# EAGLE design ESP32_breakout v1 (EAGLE 7.7.0)
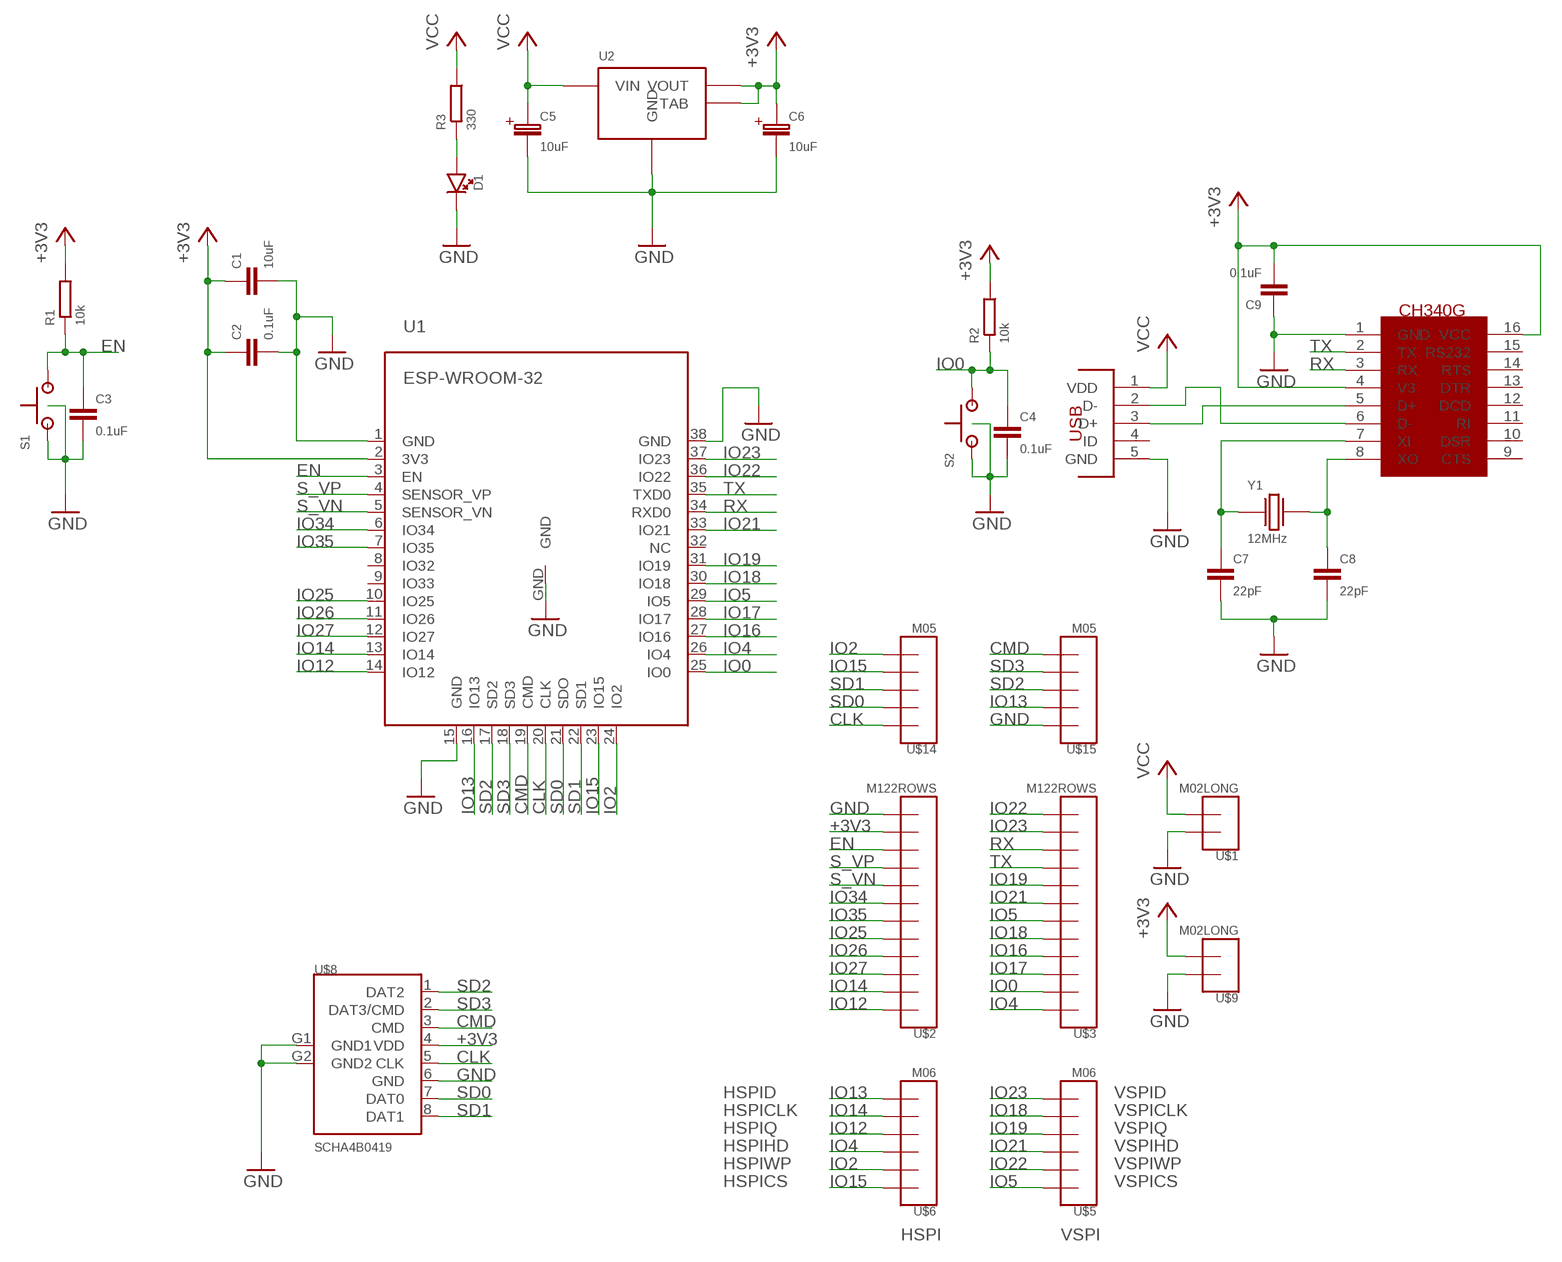
[diagram p0: schematic, sheet 1]

## Parts
C1  10uF  CAP0603  [CAP-0603]
C2  0.1uF  CAP0603  [CAP-0603]
C3  0.1uF  CAP0603  [CAP-0603]
C4  0.1uF  CAP0603  [CAP-0603]
C5  10uF  CAP-POLARCASEB-3528  [B-3528]
C6  10uF  CAP-POLARCASEB-3528  [B-3528]
C7  22pF  CAP0603  [CAP-0603]
C8  22pF  CAP0603  [CAP-0603]
C9  0.1uF  CAP0603  [CAP-0603]
D1  LED1206  [LED-1206]
R1  10k  RESISTOR0603  [RES-0603]
R2  10k  RESISTOR0603  [RES-0603]
R3  330  RESISTOR0603  [RES-0603]
S1  SKHMQME010  [SKHMQME010]
S2  SKHMQME010  [SKHMQME010]
U1  ESP-WROOM-32  [ESP-WROOM-32]
U2  NCP-1117  [SOT-223-4]
U$1  M02LONG  [1X02-LONG]
U$2  M122ROWS  [2X06]
U$3  M122ROWS  [2X06]
U$4  MOLEX_USBMICRO  [MOLEX_47346-001]
U$5  M06  [1X06]
U$6  M06  [1X06]
U$7  CH340G  [SOIC16]
U$8  SCHA4B0419  [MICROSD_SCHA4B0419]
U$9  M02LONG  [1X02-LONG]
U$14  M05  [1X05]
U$15  M05  [1X05]
Y1  12MHz  ABLS-12MHZ-B2-T  [HC-49/US]

## Nets
+3V3: C1.1 C2.1 C6.P C9.2 R1.2 R2.2 U1.2(3V3) U2.2(VOUT) U2.PAD(TAB) U$2.11 U$7.4(V3) U$7.16(VCC) U$8.4(VDD) U$9.2
CLK: U1.20(CLK) U$8.5(CLK) U$14.1
CMD: U1.19(CMD) U$8.3(CMD) U$15.5
EN: C3.1 R1.1 S1.3 U1.3(EN) U$2.10
GND: C1.2 C2.2 C3.2 C4.2 C5.N C6.N C7.2 C8.2 C9.1 D1.C S1.1 S1.5 S2.1 S2.5 U1.1(GND) U1.15(GND) U1.38(GND) U1.GND U2.1(GND) U$1.1 U$2.12 U$4.5(GND) U$7.1(GND) U$8.6(GND) U$8.G1(GND1) U$8.G2(GND2) U$9.1 U$15.1
IO0: C4.1 R2.1 S2.3 U1.25(IO0) U$3.2
IO2: U1.24(IO2) U$6.2 U$14.5
IO4: U1.26(IO4) U$3.1 U$6.3
IO5: U1.29(IO5) U$3.6 U$5.1
IO12: U1.14(IO12) U$2.1 U$6.4
IO13: U1.16(IO13) U$6.6 U$15.2
IO14: U1.13(IO14) U$2.2 U$6.5
IO15: U1.23(IO15) U$6.1 U$14.4
IO16: U1.27(IO16) U$3.4
IO17: U1.28(IO17) U$3.3
IO18: U1.30(IO18) U$3.5 U$5.5
IO19: U1.31(IO19) U$3.8 U$5.4
IO21: U1.33(IO21) U$3.7 U$5.3
IO22: U1.36(IO22) U$3.12 U$5.2
IO23: U1.37(IO23) U$3.11 U$5.6
IO25: U1.10(IO25) U$2.5
IO26: U1.11(IO26) U$2.4
IO27: U1.12(IO27) U$2.3
IO34: U1.6(IO34) U$2.7
IO35: U1.7(IO35) U$2.6
N$1: D1.A R3.1
N$3: C7.1 U$7.7(XI) Y1.P$1
N$4: C8.1 U$7.8(XO) Y1.P$2
N$5: U$4.3(D+) U$7.5(D+)
N$6: U$4.2(D-) U$7.6(D-)
RX: U1.34(RXD0) U$3.10 U$7.3(RX)
S_VN: U1.5(SENSOR_VN) U$2.8
S_VP: U1.4(SENSOR_VP) U$2.9
SD0: U1.21(SDO) U$8.7(DAT0) U$14.2
SD1: U1.22(SD1) U$8.8(DAT1) U$14.3
SD2: U1.17(SD2) U$8.1(DAT2) U$15.3
SD3: U1.18(SD3) U$8.2(DAT3/CMD) U$15.4
TX: U1.35(TXD0) U$3.9 U$7.2(TX)
VCC: C5.P R3.2 U2.3(VIN) U$1.2 U$4.1(VDD)
Unconnected: U1.8(IO32) U1.9(IO33) U1.32(NC) U$4.4(ID) U$7.9(CTS) U$7.10(DSR) U$7.11(RI) U$7.12(DCD) U$7.13(DTR) U$7.14(RTS) U$7.15(RS232)

## Notes on the sheet
- HSPID | VSPID
- HSPICLK | VSPICLK
- HSPIQ | VSPIQ
- HSPIHD | VSPIHD
- HSPIWP | VSPIWP
- HSPICS | VSPICS
- HSPI | VSPI

## Library data of the parts
C1-C4 C7-C9 = dr-library:CAP: Multilayer Ceramic Capacitor
C5 C6 = dr-library:CAP-POLAR
D1 = dr-library:LED
R1-R3 = dr-library:RESISTOR
S1 S2 = dr-library:SKHMQME010: ALPS Tactile Switch 50mA at 12V Mouser Product # 688-SKHMQME010
U1 = dr-library:ESP-WROOM-32
U2 = dr-library:NCP-1117: ON Semiconductor Low Dropout Positive Voltage Regulator 1A output Datasheet: http://www.mouser.com/ds/2/308/NCP1117LP-D-82673.pdf
U$1 U$9 = dr-library:M02
U$2 U$3 = dr-library:M12
U$4 = dr-library:MOLEX_USBMICRO
U$5 U$6 = dr-library:M06
U$7 = usb-serial:CH340G
U$8 = dr-library:SCHA4B0419: ALPS MicroSD Connector Manufacturer No. SCHA4B0419 http://www2.mouser.com/ProductDetail/ALPS/SCHA4B0419/?qs=sGAEpiMZZMuJakaoiLiBpsFSICW6cUCj0ci6XSEAGXcTwv1T7afZMw%3d%3d
U$14 U$15 = dr-library:M05
Y1 = dr-library:ABLS-12MHZ-B2-T: Abracon 12MHz Crystal 20ppm 18pF Load Cap Manufacturer Part No. - ABLS-12.000MHZ-B2-T

## Board
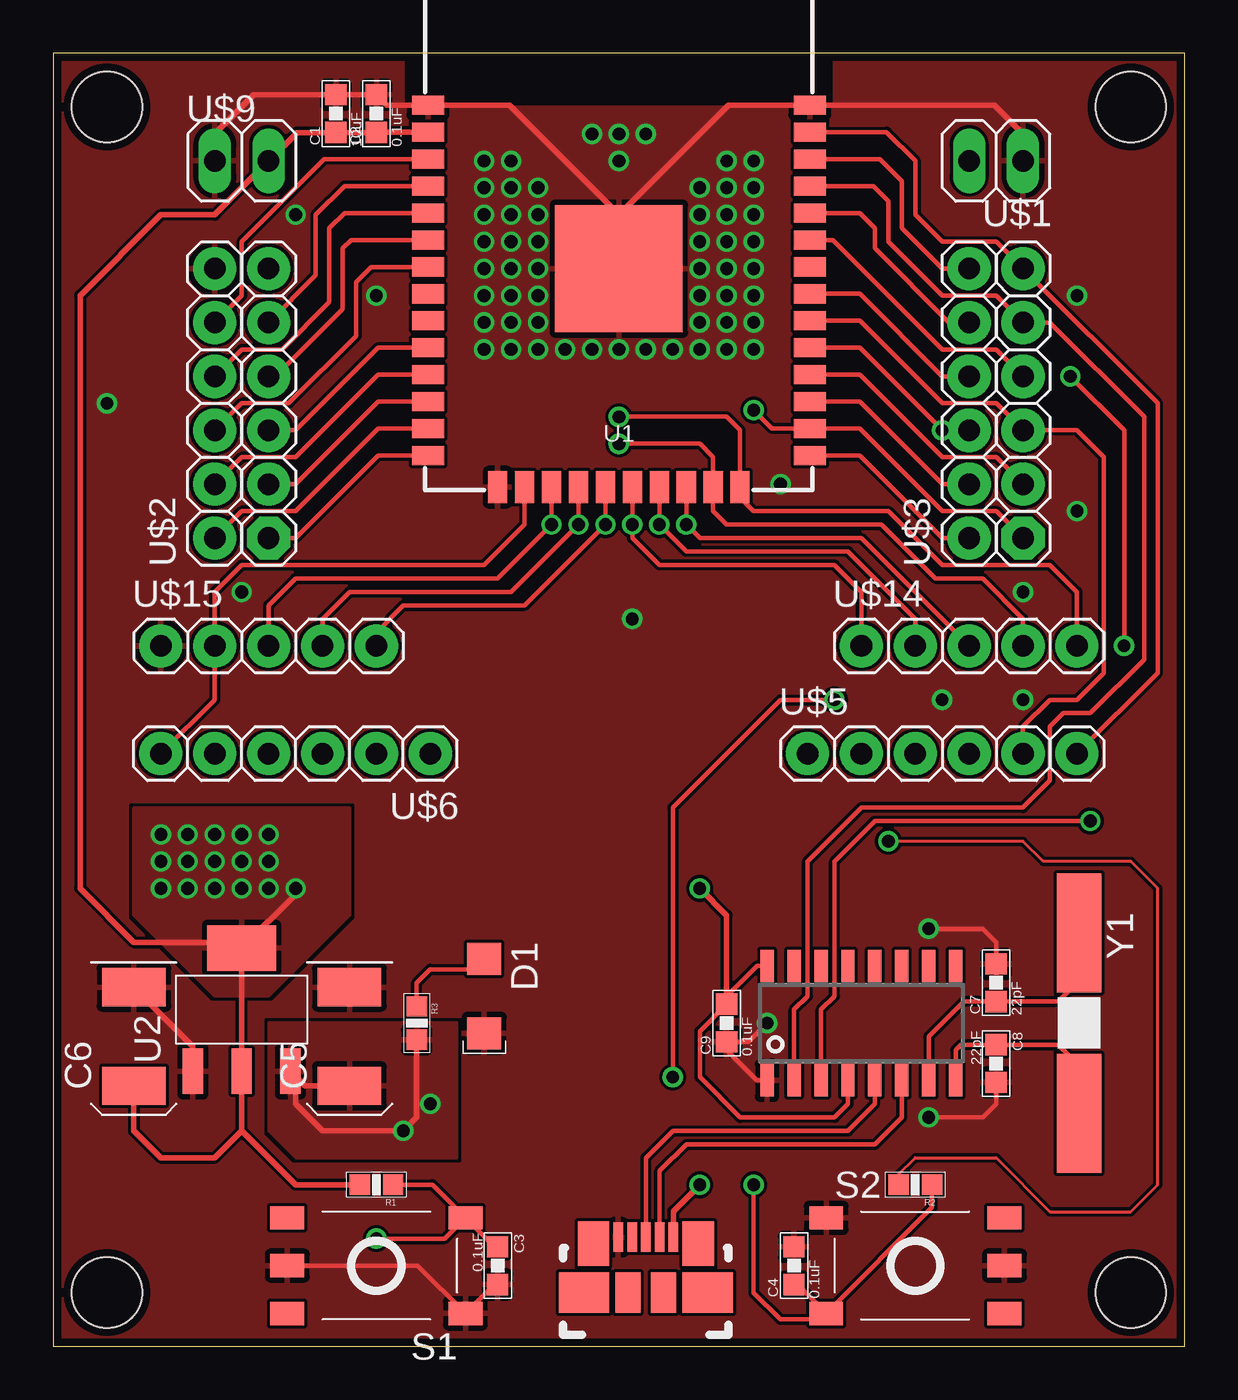
[diagram p1: board, top side]
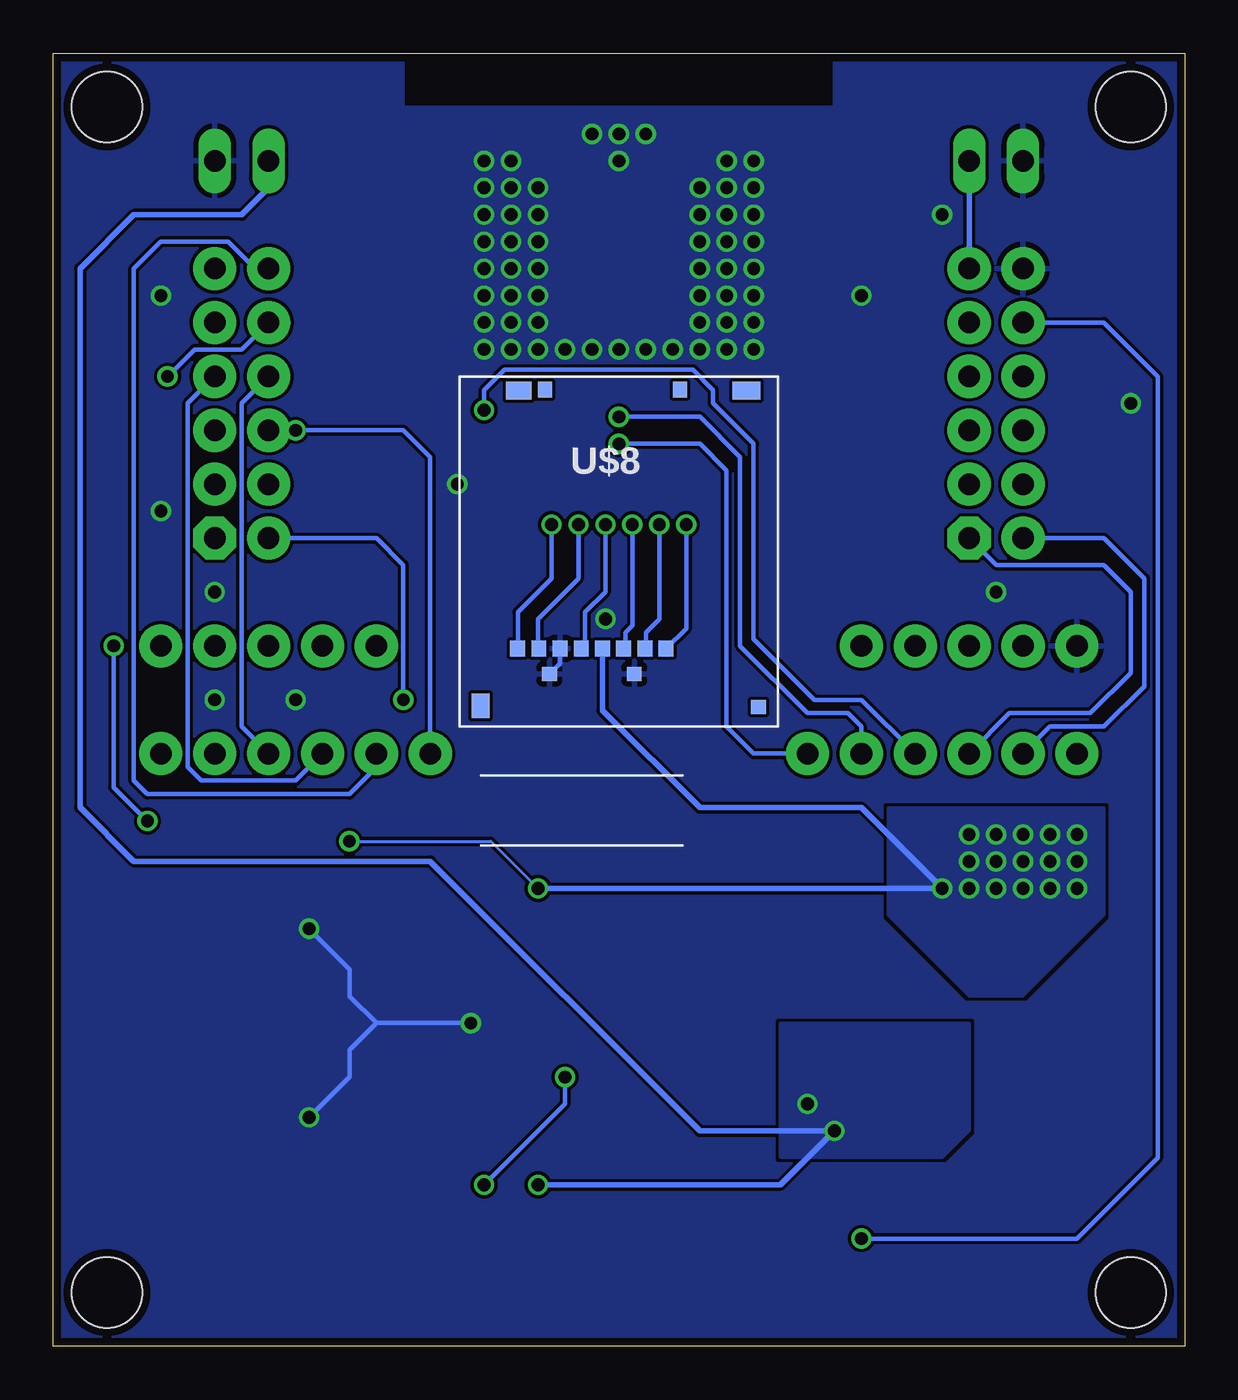
[diagram p2: board, bottom side, seen from below]

Size 53.34 x 60.96 mm. Coordinates in mm from the lower left corner, seen from the top.
Outline: 0,0 53.34,0 53.34,60.96 0,60.96 0,0
Copper layers (1*16): Top 0.0356mm / dielectric 1.5011mm / Bottom 0.0356mm
Design rules "oshpark-2layer": minimum track width 6mil, minimum drill 13mil, track to track 6mil, track to pad 6mil, pad to pad 6mil, via to via 6mil, smd to smd 6mil, copper to edge 15mil, drill to drill 6mil, minimum pad ring 7mil, minimum via ring 7mil, stop-mask expansion 2.5mil, vias tented up to drill 0mil, thermal gap 10mil

### Footprints (pad centres in the part's own frame; a part is rotated, then mirrored left to right if it is on the bottom)
CAP-0603 = smd 1 x 1: 1 -0.889,0; 2 0.889,0
B-3528 = smd 1.8 x 3: N 2.325,0; P -2.325,0
LED-1206 = smd 1.5 x 1.6: A -1.75,0; C 1.75,0
RES-0603 = smd 0.965 x 0.965: 1 -0.787,0; 2 0.787,0
SKHMQME010 = smd 1.6 x 1.1: 1 -4.2,2.25; 2 4.2,2.25; 3 -4.2,-2.25; 4 4.2,-2.25; 5 4.2,0
ESP-WROOM-32 = smd 0.9 x 1.5: 1 7.7,9; 2 6.43,9; 3 5.16,9; 4 3.89,9; 5 2.62,9; 6 1.35,9; 7 0.08,9; 8 -1.19,9; 9 -2.46,9; 10 -3.73,9; 11 -5,9; 12 -6.27,9; 13 -7.54,9; 14 -8.81,9; 25 -8.81,-9; 26 -7.54,-9; 27 -6.27,-9; 28 -5,-9; 29 -3.73,-9; 30 -2.46,-9; 31 -1.19,-9; 32 0.08,-9; 33 1.35,-9; 34 2.62,-9; 35 3.89,-9; 36 5.16,-9; 37 6.43,-9; 38 7.7,-9 | smd 1.5 x 0.9: 15 -10.3,5.715; 16 -10.3,4.445; 17 -10.3,3.175; 18 -10.3,1.905; 19 -10.3,0.635; 20 -10.3,-0.635; 21 -10.3,-1.905; 22 -10.3,-3.175; 23 -10.3,-4.445; 24 -10.3,-5.715 | smd 6 x 6: GND 0,0
SOT-223-4 = smd 0.95 x 2.15: 1 -2.3,-2.9; 2 0,-2.9; 3 2.3,-2.9 | smd 3.25 x 2.15: PAD 0,2.9
1X02-LONG = drill 1.016 long: 1 -1.27,0; 2 1.27,0
2X06 = drill 1.016 pad 2.032 octagon: 1 -1.27,-2.54 | drill 1.016 pad 2.032: 2 -1.27,0; 3 1.27,-2.54; 4 1.27,0; 5 3.81,-2.54; 6 3.81,0; 7 6.35,-2.54; 8 6.35,0; 9 8.89,-2.54; 10 8.89,0; 11 11.43,-2.54; 12 11.43,0
MOLEX_47346-001 = smd 1.38 x 0.45: 1 2.61,-1.3; 2 2.61,-0.65; 3 2.61,0; 4 2.61,0.65; 5 2.61,1.3 | smd 2.1 x 1.475: P$1 2.3,2.462; P$2 2.3,-2.462 | smd 1.9 x 1.175: P$3 0,0.838; P$4 0,-0.838 | smd 1.9 x 2.375: P$5 0,2.913; P$6 0,-2.913
1X06 = drill 1.016 pad 2.032: 1 -1.27,0; 2 1.27,0; 3 3.81,0; 4 6.35,0; 5 8.89,0; 6 11.43,0
SOIC16 = smd 0.635 x 1.524: 1 -4.445,-2.695; 2 -3.175,-2.695; 3 -1.905,-2.695; 4 -0.635,-2.695; 5 0.635,-2.695; 6 1.905,-2.695; 7 3.175,-2.695; 8 4.445,-2.695; 9 4.445,2.695; 10 3.175,2.695; 11 1.905,2.695; 12 0.635,2.695; 13 -0.635,2.695; 14 -1.905,2.695; 15 -3.175,2.695; 16 -4.445,2.695
MICROSD_SCHA4B0419 = smd 0.7 x 0.75: 1 2.225,-12.825; 2 1.225,-12.825; 3 0.225,-12.825; 4 -0.775,-12.825; 5 -1.775,-12.825; 6 -2.775,-12.825; 7 -3.775,-12.825; 8 -4.775,-12.825 | smd 0.7 x 0.65: G1 -3.275,-14.025; G2 0.725,-14.025; P$1 6.575,-15.575 | smd 0.855 x 1.15: P$2 -6.515,-15.525 | smd 1.2 x 0.85: P$3 -4.713,-0.675 | smd 0.65 x 0.75: P$4 -3.475,-0.625; P$5 2.875,-0.625 | smd 1.3 x 0.85: P$6 6.013,-0.675
STAND-OFF-HOLE = hole 3.3: 0,0
1X05 = drill 1.016 pad 2.032: 1 -1.27,0; 2 1.27,0; 3 3.81,0; 4 6.35,0; 5 8.89,0
HC-49/US = smd 5.6 x 2.1: P$1 -4.25,0.1; P$2 4.25,0.1

### Placement (x,y rotation side)
C1  13.34,58.1 90 top
C2  15.24,58.1 90 top
C3  20.95,3.81 270 top
C4  34.92,3.81 90 top
C5  13.97,14.61 90 top
C6  3.81,14.61 90 top
C7  44.45,17.14 90 top
C8  44.45,13.34 270 top
C9  31.75,15.24 90 top
D1  20.32,16.51 270 top
R1  15.24,7.62 180 top
R2  40.64,7.62 180 top
R3  17.14,15.24 270 top
S1  15.24,3.81 180 top
S2  40.64,3.81 0 top
U1  26.67,50.8 90 top
U2  8.89,15.88 0 top
U$1  44.45,55.88 180 top
U$2  7.62,39.37 90 top
U$3  43.18,39.37 90 top
U$4  27.94,2.54 90 top
U$5  36.83,27.94 0 top
U$6  16.51,27.94 180 top
U$7  38.1,15.24 0 top
U$8  26.67,45.72 0 bottom
U$9  8.89,55.88 0 top
U$10  [STAND-OFF-HOLE]  2.54,2.54 0 top
U$11  [STAND-OFF-HOLE]  50.8,2.54 0 top
U$12  [STAND-OFF-HOLE]  50.8,58.42 0 top
U$13  [STAND-OFF-HOLE]  2.54,58.42 0 top
U$14  39.37,33.02 0 top
U$15  6.35,33.02 0 top
Y1  48.26,15.24 270 top

### Tracks (layer width: path | path; a pad name or v marks a point on that pad's centre or on a via)
+3V3  (via drill 0.6)
  Top 0.152: R2.2 39.85,8.1 40.64,8.89 44.45,8.89 46.99,6.35 50.8,6.35 52.07,7.62 52.07,21.59 50.8,22.86 46.67,22.86 45.72,23.81 v39.37,23.81
  Top 0.203: U$7.16 33.17,17.93 31.75,16.51 C9.2 30.48,14.86 30.48,12.7 32.38,10.79 36.83,10.79 37.47,11.43 U$7.4
  Top 0.254: U2.PAD U2.2 8.89,10.16 | C6.P 3.81,10.16 5.08,8.89 7.62,8.89 8.89,10.16 | U1.2 15.26,57.23 C2.1 C1.1 11.49,57.21 U$9.2 7.62,53.34 5.08,53.34 1.27,49.53 1.27,21.59 3.81,19.05 8.62,19.05 U2.PAD | v11.43,21.59 11.43,21.32 U2.PAD | 31.75,16.51 31.75,20.32 v30.48,21.59 | R1.2 11.43,7.62 8.89,10.16
  Bottom 0.152: v39.37,23.81 32.7,23.81 v30.48,21.59
  Bottom 0.254: U$8.4 27.45,29.98 22.86,25.4 15.24,25.4 v11.43,21.59 v30.48,21.59 | U$2.11 U$9.2
  other vias: 10.16,21.59 8.89,21.59 7.62,21.59 6.35,21.59 5.08,21.59 5.08,22.86 6.35,22.86 7.62,22.86 8.89,22.86 10.16,22.86 10.16,24.13 8.89,24.13 7.62,24.13 5.08,24.13 6.35,24.13
  pour Top: 10.16,16.51 7.62,16.51 3.81,20.32 3.81,25.4 13.97,25.4 13.97,20.32
  pour Bottom: 3.81,25.4 3.81,20.32 7.62,16.51 10.16,16.51 13.97,20.32 13.97,25.4
CLK  (via drill 0.6)
  Top 0.203: U1.20 v27.3,38.73 27.3,38.1 28.57,36.83 36.83,36.83 38.1,35.56 U$14.1
  Bottom 0.203: v27.3,38.73 27.3,35.56 28.26,34.61 28.26,33.08 U$8.5
CMD  (via drill 0.6)
  Top 0.203: U1.19 v26.04,38.73 22.23,34.92 16.51,34.92 15.24,33.66 U$15.5
  Bottom 0.203: v26.04,38.73 26.04,33.97 26.35,33.66 26.35,32.99 U$8.3
EN  (via drill 0.6)
  Top 0.203: U1.3 12.78,55.96 8.89,52.07 8.89,49.53 U$2.10 | R1.1 17.88,7.62 S1.3 | C3.1 20.8,4.7 S1.3 | v15.24,5.08 18.46,5.08 S1.3
  Bottom 0.203: U$2.10 3.81,48.26 1.27,45.72 1.27,8.89 5.08,5.08 v15.24,5.08
GND  (via drill 0.6)
  Top 0.203: C3.2 20.8,2.92 S1.1 17.19,3.81 S1.5 | U$7.1 33.17,12.54 31.75,13.97 C9.1 32.77,14.35 v33.66,15.24 | v41.27,19.68 43.81,19.68 44.45,19.05 C7.2 | C8.2 44.45,11.43 43.81,10.79 v41.27,10.79
  Top 0.254: U2.1 6.59,14.15 C6.N | U$9.1 7.62,57.15 9.46,58.99 C1.2 C2.2 15.73,58.5 U1.1 21.51,58.5 26.67,53.34 | U$1.1 45.72,57.15 44.37,58.5 U1.38 31.83,58.5 26.67,53.34 | 26.67,53.34 U1.GND
  Bottom 0.203: v33.66,15.24 38.1,15.24 | 38.1,15.24 39.37,16.51 39.37,17.78 v41.27,19.68 | v41.27,10.79 39.37,12.7 39.37,13.97 38.1,15.24 | U$8.6 29.45,32.2 U$8.G1
  other vias: 48.26,49.53 48.26,39.37 11.43,53.34 22.86,46.99 24.13,46.99 25.4,46.99 26.67,46.99 27.94,46.99 29.21,46.99 30.48,46.99 31.75,46.99 33.02,46.99 21.59,46.99 20.32,46.99 20.32,48.26 21.59,48.26 22.86,48.26 22.86,49.53 21.59,49.53 20.32,49.53 20.32,50.8 21.59,50.8 22.86,50.8 22.86,52.07 21.59,52.07 20.32,52.07 20.32,53.34 21.59,53.34 22.86,53.34 22.86,54.61 21.59,54.61 20.32,54.61 20.32,55.88 21.59,55.88 30.48,54.61 31.75,55.88 33.02,55.88 33.02,54.61 31.75,54.61 31.75,53.34 33.02,53.34 30.48,53.34 30.48,52.07 31.75,52.07 33.02,52.07 33.02,50.8 31.75,50.8 30.48,50.8 30.48,49.53 31.75,49.53 33.02,49.53 33.02,48.26 31.75,48.26 30.48,48.26 26.67,55.88 26.67,57.15 27.94,57.15 25.4,57.15 15.24,49.53 2.54,44.45 8.89,35.56 34.29,40.64 41.91,30.48 27.3,34.29 45.72,30.48 45.72,35.56
  pour Top (rank 2): 0,0 0,60.96 16.51,60.96 16.51,58.42 36.83,58.42 36.83,60.96 53.34,60.96 53.34,0
  pour Bottom (rank 2): 0,60.96 0,0 53.34,0 53.34,60.96 36.83,60.96 36.83,58.42 17.78,58.42 16.51,58.42 16.51,60.96
IO0  (via drill 0.6)
  Top 0.203: U1.25 38.02,41.99 41.91,38.1 U$3.2 | R2.1 41.43,6.55 S2.3 | C4.1 35.08,2.92 S2.3 | v29.21,12.7 29.21,25.4 34.29,30.48 v36.83,30.48 | v33.02,7.62 33.02,2.54 34.29,1.27 36.15,1.27 S2.3
  Bottom 0.203: v29.21,12.7 29.21,11.43 v33.02,7.62 | U$3.2 38.1,38.1 36.83,36.83 v36.83,30.48
IO2  (via drill 0.6)
  Top 0.203: U$14.5 48.26,35.56 46.99,36.83 41.91,36.83 39.37,39.37 33.02,39.37 32.38,40.01 U1.24 32.38,43.18 31.75,43.81 v26.67,43.81
  Bottom 0.203: v26.67,43.81 22.86,43.81 20.95,41.91 20.95,33.02 17.78,29.84 15.88,29.84 15.24,29.21 U$6.2
IO4  (via drill 0.6)
  Top 0.203: U$3.1 44.45,39.37 41.91,39.37 38.02,43.26 U1.26 33.89,43.26 v33.02,44.13
  Bottom 0.203: U$6.3 15.24,30.48 17.46,30.48 20.32,33.34 20.32,42.55 22.23,44.45 22.23,45.09 23.18,46.04 32.07,46.04 33.02,45.09 v33.02,44.13
IO5  (via drill 0.6)
  Top 0.203: U1.29 38.02,47.07 v41.91,43.18 U$3.6
  Bottom 0.203: v41.91,43.18 36.83,43.18 35.56,41.91 U$5.1
IO12
  Top 0.203: U1.14 15.32,41.99 11.43,38.1 U$2.1
  Bottom 0.203: U$2.1 8.89,36.83 3.81,36.83 2.54,35.56 2.54,31.75 4.45,29.84 8.26,29.84 U$6.4
IO13
  Top 0.203: U1.16 22.23,38.73 20.32,36.83 8.89,36.83 7.62,35.56 U$15.2 7.62,30.48 U$6.6
IO14
  Top 0.203: U1.13 15.32,43.26 11.43,39.37 8.89,39.37 U$2.2
  Bottom 0.203: U$2.2 3.81,38.1 1.91,36.2 1.91,31.11 3.81,29.21 6.35,29.21 U$6.5
IO15  (via drill 0.6)
  Top 0.203: U$14.4 45.72,34.29 43.81,36.2 41.59,36.2 39.05,38.73 31.75,38.73 31.11,39.37 U1.23 31.11,41.91 30.48,42.55 v26.67,42.55
  Bottom 0.203: v26.67,42.55 22.86,42.55 21.59,41.27 21.59,29.21 20.32,27.94 U$6.1
IO16
  Top 0.203: U1.27 38.02,44.53 41.91,40.64 U$3.4
IO17
  Top 0.203: U1.28 38.02,45.8 41.91,41.91 44.45,41.91 U$3.3
IO18
  Top 0.203: U1.30 38.02,48.34 41.91,44.45 44.45,44.45 U$3.5 48.26,43.18 49.53,41.91 49.53,31.75 48.26,30.48 46.99,30.48 45.72,29.21 U$5.5
IO19
  Top 0.203: U1.31 38.02,49.61 41.91,45.72 U$3.8
  Bottom 0.203: U$5.4 44.45,29.21 44.45,44.45 U$3.8
IO21
  Top 0.203: U1.33 36.75,52.15 41.91,46.99 44.45,46.99 U$3.7
  Bottom 0.203: U$5.3 41.91,26.67 46.35,26.67 46.99,27.3 46.99,44.45 U$3.7
IO22
  Top 0.203: U$3.12 41.91,50.8 40.01,52.7 40.01,54.93 38.97,55.96 U1.36
  Bottom 0.203: U$5.2 38.1,27.3 39.37,26.04 48.9,26.04 49.53,26.67 49.53,50.8 48.26,52.07 45.09,52.07 43.81,50.8 U$3.12
IO23
  Top 0.203: U1.37 39.29,57.23 40.64,55.88 40.64,53.34 41.91,52.07 44.45,52.07 U$3.11 52.07,44.45 52.07,31.75 U$5.6
IO25
  Top 0.203: U1.10 15.32,47.07 11.43,43.18 U$2.5
IO26
  Top 0.203: U1.11 15.32,45.8 11.43,41.91 8.89,41.91 U$2.4
IO27
  Top 0.203: U1.12 15.32,44.53 11.43,40.64 U$2.3
IO34
  Top 0.203: U1.6 14.05,52.15 13.65,51.75 13.65,48.9 10.79,46.04 10.48,46.04 U$2.7
IO35
  Top 0.203: U1.7 15,50.88 14.29,50.16 14.29,47.62 11.11,44.45 8.89,44.45 U$2.6
N$1
  Top 0.203: R3.1 17.14,17.14 17.78,17.78 19.84,17.78 D1.A
N$3
  Top 0.203: Y1.P$1 48.26,19.39 48.26,17.14 47.37,16.26 C7.1 42.93,16.26 41.27,14.61 U$7.7
N$4
  Top 0.203: Y1.P$2 48.26,11.09 48.26,13.34 47.37,14.22 C8.1 42.8,14.22 42.55,13.97 U$7.8
N$5
  Top 0.203: U$4.3 27.94,8.89 29.21,10.16 37.47,10.16 38.73,11.43 U$7.5
N$6
  Top 0.203: U$4.2 28.59,8.27 29.84,9.53 38.73,9.53 40.01,10.79 U$7.6
RX  (via drill 0.6)
  Top 0.203: U1.34 38.02,53.42 38.73,52.7 38.73,51.75 42.23,48.26 U$3.10 | U$7.3 36.2,15.88 36.83,16.51 36.83,22.86 38.73,24.77 v48.9,24.77 | v47.94,45.72 50.48,43.18 v50.48,33.02
  Bottom 0.203: 42.23,48.26 U$3.10 44.45,46.99 46.67,46.99 v47.94,45.72 | v50.48,33.02 50.48,26.35 v48.9,24.77
S_VN
  Top 0.203: U1.5 13.73,53.42 13.02,52.7 13.02,49.21 10.79,46.99 8.89,46.99 U$2.8
S_VP
  Top 0.203: U1.4 13.73,54.69 12.38,53.34 12.38,50.48 U$2.9
SD0  (via drill 0.6)
  Top 0.203: U1.21 v28.57,38.73 29.84,37.47 37.47,37.47 40.64,34.29 U$14.2
  Bottom 0.203: v28.57,38.73 28.57,36.2 30.48,34.29 30.48,32.93 U$8.7
SD1  (via drill 0.6)
  Top 0.203: U1.22 v29.84,38.73 30.48,38.1 38.1,38.1 U$14.3
  Bottom 0.203: v29.84,38.73 29.84,36.2 31.43,34.61 31.43,32.91 U$8.8
SD2  (via drill 0.6)
  Top 0.203: U1.17 v23.5,38.73 20.95,36.2 11.43,36.2 10.16,34.92 U$15.3
  Bottom 0.203: v23.5,38.73 23.5,33.84 U$8.1
SD3  (via drill 0.6)
  Top 0.203: U1.18 v24.77,38.73 21.59,35.56 13.97,35.56 12.7,34.29 U$15.4
  Bottom 0.203: v24.77,38.73 24.77,34.29 25.4,33.66 25.4,32.94 U$8.2
TX
  Top 0.203: U1.35 38.66,54.69 39.37,53.98 39.37,52.07 41.91,49.53 44.45,49.53 U$3.9 46.99,48.26 51.44,43.81 51.44,32.38 48.9,29.84 47.62,29.84 46.99,29.21 46.99,26.67 45.72,25.4 38.1,25.4 35.56,22.86 35.56,16.51 34.92,15.88 U$7.2
VCC  (via drill 0.6)
  Top 0.254: C5.P 11.88,12.28 U2.3 11.43,12.73 11.43,11.43 12.7,10.16 v16.51,10.16 17.14,10.79 R3.2 | U$4.1 29.24,6.38 v30.48,7.62
  Bottom 0.254: U$1.2 43.18,54.61 44.45,53.34 49.53,53.34 52.07,50.8 52.07,25.4 49.53,22.86 35.56,22.86 22.86,10.16 v16.51,10.16 19.05,7.62 v30.48,7.62
  other vias: 17.78,11.43
  pour Top: 10.16,15.24 10.16,10.16 11.43,8.89 19.05,8.89 19.05,13.97 19.05,15.24
  pour Bottom: 10.16,15.24 10.16,10.16 11.43,8.89 19.05,8.89 19.05,15.24